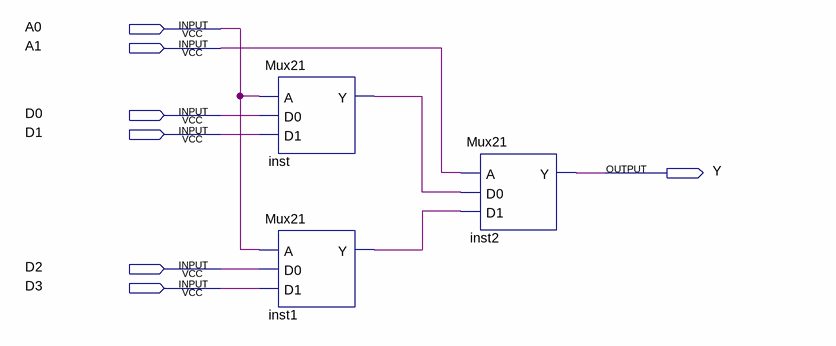
[diagram p0: schematic sheet]
// Quartus schematic Mux41.bdf as structural Verilog: 3 symbols, 7 pins
module Mux41 (
  input  A0,
  input  A1,
  input  D0,
  input  D1,
  input  D2,
  input  D3,
  output Y
);

  wire inst1_y, inst_y;

  Mux21 inst (.A(A0), .D0(D0), .D1(D1), .Y(inst_y));
  Mux21 inst1 (.A(A0), .D0(D2), .D1(D3), .Y(inst1_y));
  Mux21 inst2 (.A(A1), .D0(inst_y), .D1(inst1_y), .Y(Y));
endmodule
